# Altium schematic sheet 24Vto5Vat1A-R1.SchDoc
size A
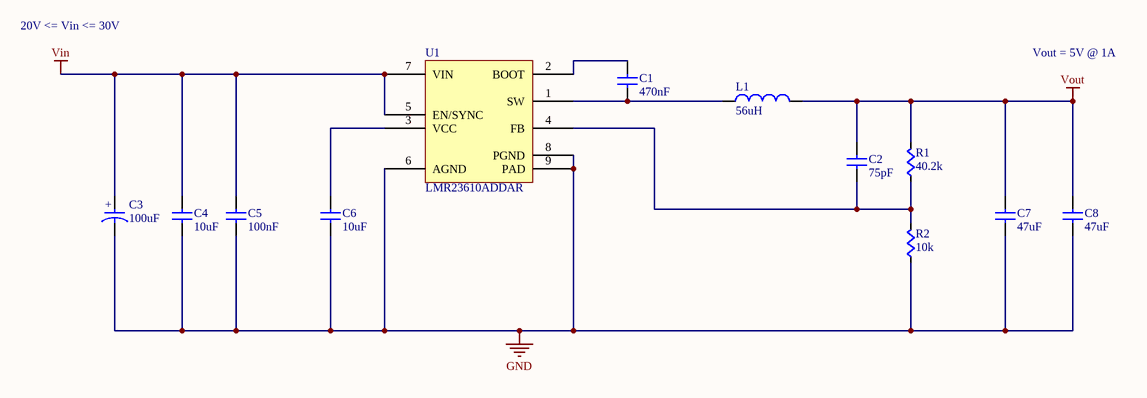
[diagram p0: 24Vto5Vat1A-R1.SchDoc]

## Parts
C1  value 470nF  [CAPC0603]  (hidden comment: Cap)
C2  value 75pF  [CAPC0603]  (hidden comment: Cap)
C3  value 100uF  [EEHZA1H101P]  (hidden comment: EEHZA1H101P)
C4  value 10uF  [CAP1210]  (hidden comment: Cap)
C5  value 100nF  [CAPC0603]  (hidden comment: Cap)
C6  value 10uF  [CAPC0603]  (hidden comment: Cap)
C7  value 47uF  [CAP1210]  (hidden comment: Cap)
C8  value 47uF  [CAP1210]  (hidden comment: Cap)
L1  value 56uH  [MSS1048-563MLB]  (hidden comment: MSS1048-563MLB)
R1  value 40.2k  [RES0603]  (hidden comment: Res)
R2  value 10k  [RES0603]  (hidden comment: Res)
U1  LMR23610ADDAR  [LMR23610ADDAR]

## Nets
GND: C3.2 C4.2(B) C5.2(B) C6.2(B) C7.2(B) C8.2(B) R2.2(B) U1.6(AGND) U1.8(PGND) U1.9(PAD)
Vin: C3.1 C4.1(A) C5.1(A) U1.5(EN/SYNC) U1.7(VIN)
Vout: C2.1(A) C7.1(A) C8.1(A) L1.2 R1.1(A)
NetC1_1: C1.1(A) U1.2(BOOT)
NetC1_2: C1.2(B) L1.1 U1.1(SW)
NetC2_2: C2.2(B) R1.2(B) R2.1(A) U1.4(FB)
NetC6_1: C6.1(A) U1.3(VCC)

## Notes on the sheet
- 20V <= Vin <= 30V
- Vout = 5V @ 1A
- (in symbol EEHZA1H101P) +

## Library data of the parts
C3 = EEHZA1H101P: CAP ALUM POLY HYB 100UF 50V SMD; Manufacturer 1: Panasonic; Tolerance: 20%; Supplier 1: Digi-Key; Supplier Part Number 1: P15442CT-ND; Manufacturer Part Number 1: EEHZA1H101P; Voltage: 50V; ComponentLink1URL: https://na.industrial.panasonic.com/products/capacitors/aluminum-electrolytic-capacitors/conductive-polymer-hybrid-aluminum-electrolytic/series/za-high-temp-reflow/ABA0135/model/EEHZA1H101P; ComponentLink1Description: Web Site; ComponentLink2URL: https://industrial.panasonic.com/cdbs/www-data/pdf/RDD0000/ABA0000C1221.pdf; ComponentLink2Description: Data Sheet; ComponentLink3URL: https://industrial.panasonic.com/cdbs/www-data/pdf/RDD0000/ABA0000COS44.pdf; ComponentLink3Description: ZA Series Technical Data
L1 = MSS1048-563MLB: FIXED IND 56UH 1.7A 126 MOHM; Manufacturer 1: Coilcraft; Manufacturer Part Number 1: MSS1048-563MLB; ComponentLink1Description: Web Site; ComponentLink1URL: https://www.coilcraft.com/mss1048.cfm; Supplier 1: Coilcraft; Supplier Part Number 1: MSS1048-563MLB
U1 = LMR23610ADDAR: IC REG BUCK ADJ 1A SYNC 8SOPWRPD; Manufacturer 1: Texas Instruments; Supplier 1: Digi-Key; Supplier Part Number 1: 296-47267-1-ND; Manufacturer Part Number 1: LMR23610ADDAR; ComponentLink1URL: http://www.ti.com/lit/ds/symlink/lmr23610.pdf; ComponentLink1Description: Datasheet; ComponentLink2URL: http://www.ti.com/product/LMR23610/description; ComponentLink2Description: Web Site
C1 C2 C4-C8 = Cap: Supplier 1: Digi-Key
  C1 C2 C4-C6: Supplier Part Number 1: 1276-1000-1-ND
  C7 C8: Supplier Part Number 1: 490-6538-1-ND
R1 R2 = Res: Supplier 1: Digi-Key
  R1: Supplier Part Number 1: RMCF0603FT40K2CT-ND
  R2: Supplier Part Number 1: RMCF0603JT10K0CT-ND